# EAGLE board sch (EAGLE 7.1.0)
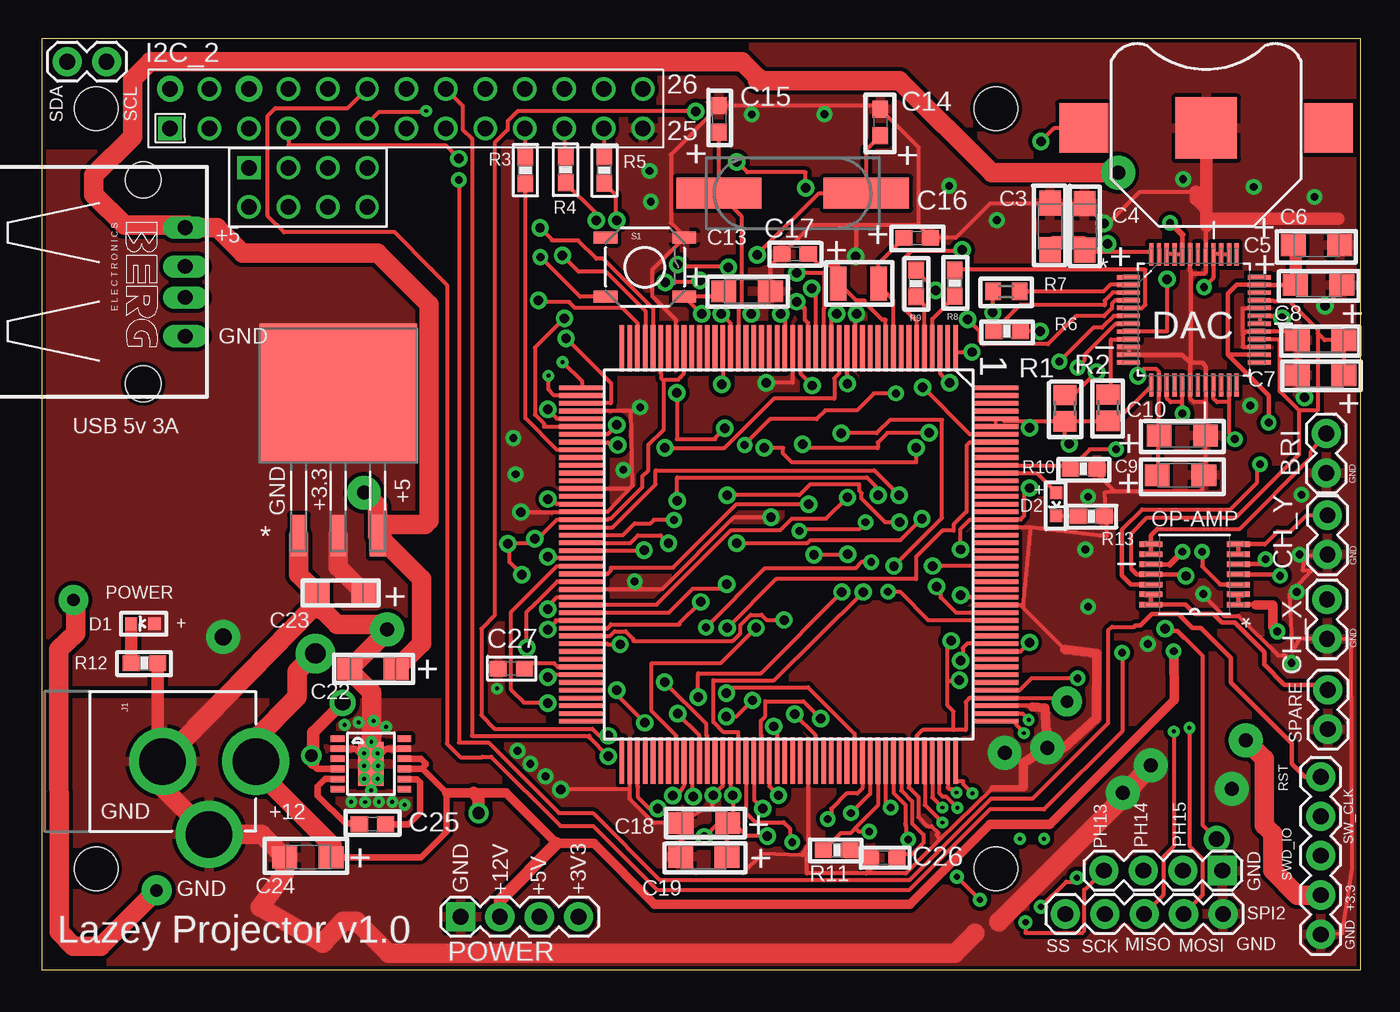
[diagram p2: board, top side]
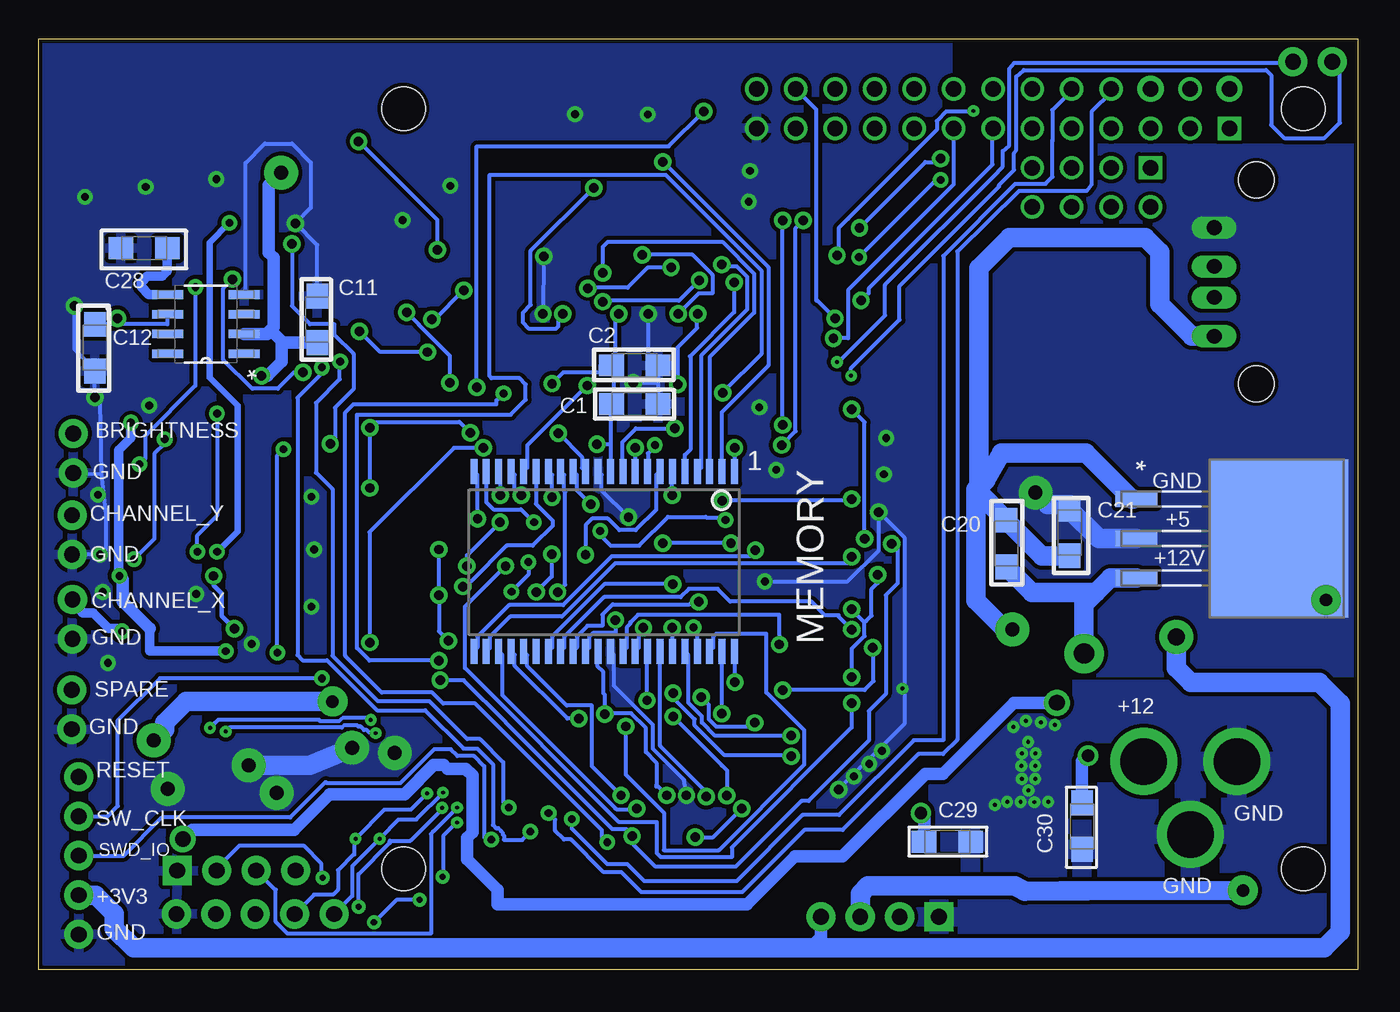
[diagram p3: board, bottom side, seen from below]

Size 85 x 60 mm. Coordinates in mm from the lower left corner, seen from the top.
Outline: 0,0 85,0 85,60 0,60 0,0
Copper layers (1*16): Top 0.035mm / dielectric 1.5mm / Bottom 0.035mm
Design rules "pcbtrain *": minimum track width 0.15mm, minimum drill 0.2mm, track to track 0.15mm, track to pad 0.15mm, pad to pad 0.15mm, via to via 0.15mm, smd to smd 0mil, copper to edge 10mil, drill to drill 0.2mm, minimum pad ring 10mil, minimum via ring 10mil, stop-mask expansion 0.125mm, vias tented up to drill 100mil, thermal gap 10mil
Net classes: 0 default: width 0.254 mm, drill 0.254 mm, clearance 0.254 mm
Holes 2.8 mm at 3.5,55.5 3.5,6.5 61.5,55.5 61.5,6.5

## Footprints (pad centres in the part's own frame; a part is rotated, then mirrored left to right if it is on the bottom)
CSM-7X-DU = smd 5.5 x 2: 1 -4.75,0; 2 4.75,0
9HT10-32.768KEZF-T = smd 1.067 x 2.184: P$1 -1.3,0; P$2 1.3,0
BATTCON_12MM = smd 3.962 x 3.962: GND 0,0 | smd 3.175 x 3.175: PWR@1 -7.874,0; PWR@2 7.874,0
1X02 = drill 1.016 pad 1.88: 1 0,0; 2 2.54,0
SMC_A = smd 1.6 x 1.4: + -1.5,0; - 1.5,0
C0603 = smd 1.1 x 1: 1 -0.85,0; 2 0.85,0
LED-0603 = smd 0.8 x 0.8: A 0,-0.75; C 0,0.75
QFP50P900X900X120-48N = smd 1.473 x 0.279: 1 -4.216,2.743; 2 -4.216,2.261; 3 -4.216,1.753; 4 -4.216,1.245; 5 -4.216,0.762; 6 -4.216,0.254; 7 -4.216,-0.254; 8 -4.216,-0.762; 9 -4.216,-1.245; 10 -4.216,-1.753; 11 -4.216,-2.261; 12 -4.216,-2.743; 25 4.216,-2.743; 26 4.216,-2.261; 27 4.216,-1.753; 28 4.216,-1.245; 29 4.216,-0.762; 30 4.216,-0.254; 31 4.216,0.254; 32 4.216,0.762; 33 4.216,1.245; 34 4.216,1.753; 35 4.216,2.261; 36 4.216,2.743 | smd 0.279 x 1.473: 13 -2.743,-4.216; 14 -2.261,-4.216; 15 -1.753,-4.216; 16 -1.245,-4.216; 17 -0.762,-4.216; 18 -0.254,-4.216; 19 0.254,-4.216; 20 0.762,-4.216; 21 1.245,-4.216; 22 1.753,-4.216; 23 2.261,-4.216; 24 2.743,-4.216; 37 2.743,4.216; 38 2.261,4.216; 39 1.753,4.216; 40 1.245,4.216; 41 0.762,4.216; 42 0.254,4.216; 43 -0.254,4.216; 44 -0.762,4.216; 45 -1.245,4.216; 46 -1.753,4.216; 47 -2.261,4.216; 48 -2.743,4.216
1X04 = drill 1.016 pad 1.88 square: 1 0,0 | drill 1.016 pad 1.88: 2 2.54,0; 3 5.08,0; 4 7.62,0
POWER_JACK_PTH = drill 2.997 pad 4.318: GND 0,7.7; GNDBREAK 4.7,10.7; PWR 0,13.7
TSOPII-44 = smd 0.45 x 1.6: 1 -7.13,-5.8; 2 -6.33,-5.8; 3 -5.53,-5.8; 4 -4.73,-5.8; 5 -3.93,-5.8; 6 -3.13,-5.8; 7 -2.33,-5.8; 8 -1.53,-5.8; 9 -0.73,-5.8; 10 0.07,-5.8; 11 0.87,-5.8; 12 1.67,-5.8; 13 2.47,-5.8; 14 3.27,-5.8; 15 4.07,-5.8; 16 4.87,-5.8; 17 5.67,-5.8; 18 6.47,-5.8; 19 7.27,-5.8; 20 8.07,-5.8; 21 8.87,-5.8; 22 9.67,-5.8; 23 9.67,5.8; 24 8.87,5.8; 25 8.07,5.8; 26 7.27,5.8; 27 6.47,5.8; 28 5.67,5.8; 29 4.87,5.8; 30 4.07,5.8; 31 3.27,5.8; 32 2.47,5.8; 33 1.67,5.8; 34 0.87,5.8; 35 0.07,5.8; 36 -0.73,5.8; 37 -1.53,5.8; 38 -2.33,5.8; 39 -3.13,5.8; 40 -3.93,5.8; 41 -4.73,5.8; 42 -5.53,5.8; 43 -6.33,5.8; 44 -7.13,5.8
LQFP176_PACKAGE = smd 3 x 0.3: 1 -13.3,10.75; 2 -13.3,10.25; 3 -13.3,9.75; 4 -13.3,9.25; 5 -13.3,8.75; 6 -13.3,8.25; 7 -13.3,7.75; 8 -13.3,7.25; 9 -13.3,6.75; 10 -13.3,6.25; 11 -13.3,5.75; 12 -13.3,5.25; 13 -13.3,4.75; 14 -13.3,4.25; 15 -13.3,3.75; 16 -13.3,3.25; 17 -13.3,2.75; 18 -13.3,2.25; 19 -13.3,1.75; 20 -13.3,1.25; 21 -13.3,0.75; 22 -13.3,0.25; 23 -13.3,-0.25; 24 -13.3,-0.75; 25 -13.3,-1.25; 26 -13.3,-1.75; 27 -13.3,-2.25; 28 -13.3,-2.75; 29 -13.3,-3.25; 30 -13.3,-3.75; 31 -13.3,-4.25; 32 -13.3,-4.75; 33 -13.3,-5.25; 34 -13.3,-5.75; 35 -13.3,-6.25; 36 -13.3,-6.75; 37 -13.3,-7.25; 38 -13.3,-7.75; 39 -13.3,-8.25; 40 -13.3,-8.75; 41 -13.3,-9.25; 42 -13.3,-9.75; 43 -13.3,-10.25; 44 -13.3,-10.75; 89 13.3,-10.75; 90 13.3,-10.25; 91 13.3,-9.75; 92 13.3,-9.25; 93 13.3,-8.75; 94 13.3,-8.25; 95 13.3,-7.75; 96 13.3,-7.25; 97 13.3,-6.75; 98 13.3,-6.25; 99 13.3,-5.75; 100 13.3,-5.25; 101 13.3,-4.75; 102 13.3,-4.25; 103 13.3,-3.75; 104 13.3,-3.25; 105 13.3,-2.75; 106 13.3,-2.25; 107 13.3,-1.75; 108 13.3,-1.25; 109 13.3,-0.75; 110 13.3,-0.25; 111 13.3,0.25; 112 13.3,0.75; 113 13.3,1.25; 114 13.3,1.75; 115 13.3,2.25; 116 13.3,2.75; 117 13.3,3.25; 118 13.3,3.75; 119 13.3,4.25; 120 13.3,4.75; 121 13.3,5.25; 122 13.3,5.75; 123 13.3,6.25; 124 13.3,6.75; 125 13.3,7.25; 126 13.3,7.75; 127 13.3,8.25; 128 13.3,8.75; 129 13.3,9.25; 130 13.3,9.75; 131 13.3,10.25; 132 13.3,10.75 | smd 0.3 x 3: 45 -10.75,-13.3; 46 -10.25,-13.3; 47 -9.75,-13.3; 48 -9.25,-13.3; 49 -8.75,-13.3; 50 -8.25,-13.3; 51 -7.75,-13.3; 52 -7.25,-13.3; 53 -6.75,-13.3; 54 -6.25,-13.3; 55 -5.75,-13.3; 56 -5.25,-13.3; 57 -4.75,-13.3; 58 -4.25,-13.3; 59 -3.75,-13.3; 60 -3.25,-13.3; 61 -2.75,-13.3; 62 -2.25,-13.3; 63 -1.75,-13.3; 64 -1.25,-13.3; 65 -0.75,-13.3; 66 -0.25,-13.3; 67 0.25,-13.3; 68 0.75,-13.3; 69 1.25,-13.3; 70 1.75,-13.3; 71 2.25,-13.3; 72 2.75,-13.3; 73 3.25,-13.3; 74 3.75,-13.3; 75 4.25,-13.3; 76 4.75,-13.3; 77 5.25,-13.3; 78 5.75,-13.3; 79 6.25,-13.3; 80 6.75,-13.3; 81 7.25,-13.3; 82 7.75,-13.3; 83 8.25,-13.3; 84 8.75,-13.3; 85 9.25,-13.3; 86 9.75,-13.3; 87 10.25,-13.3; 88 10.75,-13.3; 133 10.75,13.3; 134 10.25,13.3; 135 9.75,13.3; 136 9.25,13.3; 137 8.75,13.3; 138 8.25,13.3; 139 7.75,13.3; 140 7.25,13.3; 141 6.75,13.3; 142 6.25,13.3; 143 5.75,13.3; 144 5.25,13.3; 145 4.75,13.3; 146 4.25,13.3; 147 3.75,13.3; 148 3.25,13.3; 149 2.75,13.3; 150 2.25,13.3; 151 1.75,13.3; 152 1.25,13.3; 153 0.75,13.3; 154 0.25,13.3; 155 -0.25,13.3; 156 -0.75,13.3; 157 -1.25,13.3; 158 -1.75,13.3; 159 -2.25,13.3; 160 -2.75,13.3; 161 -3.25,13.3; 162 -3.75,13.3; 163 -4.25,13.3; 164 -4.75,13.3; 165 -5.25,13.3; 166 -5.75,13.3; 167 -6.25,13.3; 168 -6.75,13.3; 169 -7.25,13.3; 170 -7.75,13.3; 171 -8.25,13.3; 172 -8.75,13.3; 173 -9.25,13.3; 174 -9.75,13.3; 175 -10.25,13.3; 176 -10.75,13.3
SOP65P640X120-14N = smd 1.473 x 0.356: 1 -2.819,1.956; 2 -2.819,1.295; 3 -2.819,0.66; 4 -2.819,0; 5 -2.819,-0.66; 6 -2.819,-1.295; 7 -2.819,-1.956; 8 2.819,-1.956; 9 2.819,-1.295; 10 2.819,-0.66; 11 2.819,0; 12 2.819,0.66; 13 2.819,1.295; 14 2.819,1.956
1X05 = drill 1.016 pad 1.88: 1 0,0; 2 2.54,0; 3 5.08,0; 4 7.62,0; 5 10.16,0
R0805 = smd 1.3 x 1.5: 1 -0.85,0; 2 0.85,0
0603-RES = smd 1.1 x 1: 1 -0.85,0; 2 0.85,0
R0603 = smd 1 x 1.1: 1 -0.85,0; 2 0.85,0
RASPBERRY-PI_REV2-BARE = drill 1 square: P1_1 -15.24,-1.27; P5_1 -10.16,-3.81 | drill 1 pad 1.676: P1_2 -15.24,1.27; P1_6 -10.16,1.27 | drill 1: P1_3 -12.7,-1.27; P1_4 -12.7,1.27; P1_5 -10.16,-1.27; P1_7 -7.62,-1.27; P1_8 -7.62,1.27; P1_9 -5.08,-1.27; P1_10 -5.08,1.27; P1_11 -2.54,-1.27; P1_12 -2.54,1.27; P1_13 0,-1.27; P1_14 0,1.27; P1_15 2.54,-1.27; P1_16 2.54,1.27; P1_17 5.08,-1.27; P1_18 5.08,1.27; P1_19 7.62,-1.27; P1_20 7.62,1.27; P1_21 10.16,-1.27; P1_22 10.16,1.27; P1_23 12.7,-1.27; P1_24 12.7,1.27; P1_25 15.24,-1.27; P1_26 15.24,1.27; P5_2 -10.16,-6.35; P5_3 -7.62,-3.81; P5_4 -7.62,-6.35; P5_5 -5.08,-3.81; P5_6 -5.08,-6.35; P5_7 -2.54,-3.81; P5_8 -2.54,-6.35
TACTILE_SWITCH_SMD = smd 1.524 x 0.762: 1 -2.54,1.905; 2 2.54,1.905; 3 -2.54,-1.905; 4 2.54,-1.905
TO254P1435X457-3N = smd 1.016 x 2.692: 1 -2.54,-9.042; 2 0,-9.042; 3 2.54,-9.042 | smd 10.16 x 8.941: 4 0,0.152
MSOP12 = smd 0.42 x 0.889: 1 -1.625,-2.15; 2 -0.975,-2.15; 3 -0.325,-2.15; 4 0.325,-2.15; 5 0.975,-2.15; 6 1.625,-2.15; 7 1.625,2.15; 8 0.975,2.15; 9 0.325,2.15; 10 -0.325,2.15; 11 -0.975,2.15; 12 -1.625,2.15 | smd 2.845 x 1.651: 13 0,0
SOIC127P600X175-8N = smd 1.981 x 0.559: 1 -2.464,1.905; 2 -2.464,0.635; 3 -2.464,-0.635; 4 -2.464,-1.905; 5 2.464,-1.905; 6 2.464,-0.635; 7 2.464,0.635; 8 2.464,1.905
PN87520 = drill 0.95 long: 1 -3.5,2.71; 2 -1,2.71; 3 1,2.71; 4 3.5,2.71 | hole 2.3: -6.57,0; 6.57,0

## Placement (x,y rotation side)
9C-8.000MEEJ-T  8Mhz  [CSM-7X-DU]  48.38,50.04 180 top
32.768KHZ  9HT10-32.768KEZF-T  [9HT10-32.768KEZF-T]  52.62,44.22 180 top
BAT1  3.3v  [BATTCON_12MM]  75.04,54.25 0 top
BRI  M02PTH  [1X02]  82.78,32.01 90 top
C1  100n  [SMC_A]  46.59,36.45 0 bottom
C2  100n  [SMC_A]  46.59,38.94 0 bottom
C3  0.1u  [SMC_A]  64.98,47.9 90 top
C4  10u  [SMC_A]  67.2,47.87 90 top
C5  0.1u  [SMC_A]  82.29,44.13 0 top
C6  10u  [SMC_A]  82.16,46.7 0 top
C7  0.1u  [SMC_A]  82.42,38.31 0 top
C8  10u  [SMC_A]  82.41,40.57 0 top
C9  0.1u  [SMC_A]  73.38,31.87 0 top
C10  10u  [SMC_A]  73.5,34.42 0 top
C11  1u  [SMC_A]  67.05,41.91 90 bottom
C12  22u  [SMC_A]  81.39,40.09 270 bottom
C13  0.1u  [SMC_A]  45.45,43.72 0 top
C14  16p  [C0603]  54.03,54.61 270 top
C15  16p  [C0603]  43.65,54.84 270 top
C16  5p  [C0603]  56.41,47.15 180 top
C17  5p  [C0603]  48.54,46.13 0 top
C18  0.1u  [SMC_A]  42.7,9.43 180 top
C19  10u  [SMC_A]  42.65,7.25 180 top
C20  10u  [SMC_A]  22.63,27.46 90 bottom
C21  10u  [SMC_A]  18.57,28.17 270 bottom
C22  10u  [SMC_A]  21.34,19.38 180 top
C23  10u  [SMC_A]  19.25,24.29 180 top
C24  10u  [SMC_A]  17.14,7.24 180 top
C25  1u  [C0603]  21.31,9.38 0 top
C26  2.2u  [C0603]  54.25,7.21 0 top
C27  2.2u  [C0603]  30.25,19.41 0 top
C28  1u  [SMC_A]  78.21,46.51 180 bottom
C29  10u  [SMC_A]  26.44,8.23 0 bottom
C30  10u  [SMC_A]  17.75,9.25 90 bottom
CH_X  M02PTH  [1X02]  82.83,21.31 90 top
CH_Y  M02PTH  [1X02]  82.85,26.75 90 top
D1  KP-1608CGCK  [LED-0603]  6.5,22.3 90 top
D2  KP-1608CGCK  [LED-0603]  65.38,30 180 top
DAC  DAC8734SPFB  [QFP50P900X900X120-48N]  74.25,41.89 0 top
GPIO  [1X04]  76.07,6.38 180 top
I2C_2  M02PTH  [1X02]  1.63,58.52 0 top
J1  POWER_JACKPTH  [POWER_JACK_PTH]  0.08,13.41 270 top
MEMORY  AS7C34098A-12TIN  [TSOPII-44]  47.29,26.31 180 bottom
MICROCONTROLER  STM32F42X_43X_LQFP176  [LQFP176_PACKAGE]  48.13,26.76 270 top
OP-AMP  MC33074ADTBG  [SOP65P640X120-14N]  74.3,25.48 180 top
POWER  [1X04]  26.97,3.4 0 top
PROGRAM  [1X05]  82.42,2.26 90 top
R1  10k  [R0805]  65.93,36.19 90 top
R2  10k  [R0805]  68.72,36.22 90 top
R3  20R  [0603-RES]  31.17,51.51 90 top
R4  20R  [0603-RES]  33.76,51.56 90 top
R5  20R  [0603-RES]  36.25,51.54 90 top
R6  20R  [0603-RES]  62.2,41.15 0 top
R7  20R  [R0603]  62.15,43.72 180 top
R8  20  [0603-RES]  58.83,44.25 270 top
R9  20  [0603-RES]  56.34,44.22 270 top
R10  10k  [0603-RES]  67.13,32.29 0 top
R11  10k  [0603-RES]  51.23,7.7 0 top
R12  68R  [0603-RES]  6.6,19.76 180 top
R13  68R  [0603-RES]  67.64,29.21 0 top
RASPBERRY_PI  RASPBERRY-PI_REV2-BARE  [RASPBERRY-PI_REV2-BARE]  23.5,55.5 0 top
S1  [TACTILE_SWITCH_SMD]  38.87,45.28 0 top
SPARE  M02PTH  [1X02]  82.88,15.49 90 top
SPI_2  [1X05]  65.96,3.58 0 top
U2  LM1085IS-3.3  [TO254P1435X457-3N]  19.1,37.01 0 top
U3  LM1085IS-5.0  [TO254P1435X457-3N]  5.21,27.79 270 bottom
U$1  LTC3261  [MSOP12]  21.21,13.26 270 top
VREF1  REF5025AID  [SOIC127P600X175-8N]  74.23,41.61 180 bottom
X1  [PN87520]  6.53,44.33 270 top

## Tracks (layer width: path | path; a pad name or v marks a point on that pad's centre or on a via)
+3V3  (via drill 0.61, 0.8 pad 1.93, 0.9 pad 2.18, 1.1 pad 2.18)
  Top 0.254: v48.51,16.46 49.89,15.09 MICROCONTROLER.114 | 43.97,9.43 C18.+ | 44.42,9.43 44.32,9.43 C18.+ | MICROCONTROLER.103 44.37,13.44 44.37,11.38 v44.53,11.23 44.53,9.76 C18.+ | v39.7,10.37 39.17,10.37 38.43,11.1 38.43,11.79 38.38,11.84 38.38,13.44 MICROCONTROLER.91 | C18.+ 43.87,9.43 43.54,9.43 43.51,9.4 43.51,9.35 v42.7,8.54 42.6,8.46 | v32.61,23.22 32.61,23.42 33.2,24.01 MICROCONTROLER.72 | MICROCONTROLER.82 32.92,19 v32.61,18.85 | 31.86,27.68 31.7,27.51 30.12,27.51 | 31.86,27.68 33.2,29.01 MICROCONTROLER.62 34.95,29.01 36.47,29.01 36.52,29.06 36.68,29.06 38.71,31.09 38.71,31.8 39.09,32.19 39.09,33.84 40.08,34.83 40.08,37.95 | 30.12,27.51 30.12,26.27 v30.94,25.45 | v32.61,36.12 32.61,36.1 33.2,35.51 34.75,35.51 34.77,35.49 34.8,35.51 MICROCONTROLER.49 | v31.77,27.77 31.86,27.68 | 40.08,37.95 39.93,38.1 39.93,38.38 39.88,38.43 39.88,40.03 MICROCONTROLER.39 | MICROCONTROLER.36 41.38,40.03 41.38,38.41 41.17,38.2 41.17,38.18 41.02,38.03 40.18,38.03 40.08,37.95 | v30.02,27.46 30.12,27.51 | 58.75,15.45 59.54,15.45 59.54,17.25 59.79,17.5 61.42,17.5 MICROCONTROLER.136 65.83,17.5 v66.06,17.27 | 58.75,15.45 56.74,15.45 56.39,15.09 MICROCONTROLER.127 | v59.21,24.13 59.21,24.06 59.74,24.06 59.79,24.01 61.42,24.01 MICROCONTROLER.149 | 58.37,18.62 58.37,17.02 58.75,16.64 58.75,15.45 | 58.37,18.62 58.37,20.88 58.6,21.11 v58.6,21.19 | v59.21,27.08 59.21,28.4 59.82,29.01 61.42,29.01 MICROCONTROLER.159 61.54,29.01 63.07,29.01 63.32,29.26 63.32,30.71 v63.65,31.04 | MICROCONTROLER.23 47.88,42.01 v47.62,42.27 | v51.92,37.77 51.92,38.38 51.89,38.41 51.89,40.03 MICROCONTROLER.15
  Top 0.254: DAC.48 71.5,46.26 71.48,46.28 67.21,46.28 67.21,46.36 C4.+ 67.21,46.51 | 67.21,46.51 67.21,47.15 65.1,47.15 64.97,47.02 C3.+ | MICROCONTROLER.171 61.44,35.03 61.44,35.49 MICROCONTROLER.172 61.57,35.51 61.87,35.51 61.87,35.49 62.03,35.33 63.65,35.33 | DAC.13 71.5,37.65 71.5,37.62 69.42,35.54 69.42,35.41 69.39,35.38 68.73,35.38 R2.1 68.61,35.38 68.02,35.38 68,35.36 68,35.33 R1.1 | R1.1 | 63.65,35.33 65.81,35.33 R1.1 | 65.96,35.21 R1.1 | v57.17,34.6 54.48,34.6 53.87,33.99 53.87,33.61 49.28,33.61 v49.02,33.86 | 63.65,35.33 v63.65,34.93 63.32,35.23 | C18.+ 44.53,9.43 44.91,9.43 44.91,9.15 45.39,8.66 46.71,8.66 v46.76,8.61 | C19.+ 44.15,9.39 C18.+ | 67.21,46.51 68.4,46.51 v68.68,46.79 | 58.37,18.62 59.11,18.62 v59.13,18.65 | R1.1 65.94,34.98 65.91,34.95 65.91,34.19 v66.22,33.89
  Top 1.27: U2.2 19.1,25.94 C23.+ | v77.6,14.79 78.79,13.59 78.79,9.3 79.32,8.76 79.32,6.4 80.92,4.8 PROGRAM.2
  Bottom 0.254: MEMORY.33 48.97,19.54 48.62,19.18 48.62,17.81 48.51,17.71 v48.51,16.46 48.41,16.51 46.81,16.51 45.87,15.57 45.87,14.02 45.19,13.34 45.19,11.89 | v39.7,10.37 41.53,8.54 v42.7,8.54 | 45.19,11.79 45.19,11.89 | 31.77,22.38 v32.61,23.22 | 31.77,22.38 31.77,21.49 32.61,20.65 v32.61,18.85 | v30.94,25.45 30.94,24.92 31.32,24.54 31.32,22.81 31.67,22.46 31.77,22.38 | v32.61,36.12 31.77,35.28 v31.77,27.77 | v30.02,27.46 29.64,27.08 29.64,24.89 30.4,24.13 30.4,17.76 31.5,16.66 31.5,14.76 35.38,10.87 35.84,10.87 40.08,6.63 45.24,6.63 46.66,8.05 46.66,8.51 v46.76,8.61 47.14,8.99 47.14,9.04 48.03,9.04 54.89,15.9 54.89,15.93 57.61,18.64 v59.13,18.64 v59.13,18.65 | v59.21,27.08 v59.21,24.13 59.21,21.8 v58.6,21.19 | C2.+ 47.95,38.94 47.95,36.45 C1.+ 48.16,36.35 48.16,33.84 | 48.16,33.84 48.16,32.13 MEMORY.11 | C2.+ 47.85,38.92 47.83,38.94 47.83,42.06 v47.62,42.27 | v51.92,37.77 51.21,38.48 48.82,38.48 48.82,38.92 48.79,38.94 48.21,38.94 C2.+ | v57.17,34.6 57.89,35.31 63.65,35.31 v63.65,34.93 v63.65,31.04 | v49.02,33.86 48.18,33.86 48.16,33.84 | v68.68,46.79 68.68,42.78 67.51,41.61 65.96,41.61 65.96,40.95 64.72,39.7 64.72,37.42 65.91,36.22 65.91,34.19 v66.22,33.89 | 45.19,11.89 v44.53,11.23
  Bottom 0.813: POWER.4 34.59,2.08 35.28,1.4
  Bottom 1.27: v66.06,17.27 75.51,17.27 76.89,15.9 76.89,15.5 v77.6,14.79 | v11.68,21.44 11.68,19.46 10.74,18.52 2.46,18.52 1.12,17.17 1.12,2.44 2.16,1.4 35.28,1.4 78.89,1.4 80.14,2.64 80.14,3.61 81.33,4.8 PROGRAM.2
  pour Top (no thermals): -0.18,52.76 25.93,52.76 25.93,18.39 -0.05,18.39 -0.05,18.32 -0.18,18.32
+5V  (via drill 0.61, 0.8 pad 1.93, 0.9 pad 2.18)
  Top 0.254: C9.+ 71.93,31.93 71.93,34.32 C10.+ 71.98,34.45 71.98,37.65 DAC.14 71.98,37.8 71.98,38.56 71.81,38.74 70.99,38.74 70.99,38.64 v70.64,38.28 | X1.1 9.4,47.99 | 22.05,27.56 U2.3
  Top 1.27: X1.1 11.28,47.83 12.93,46.18 21.64,46.18 24.97,42.85 24.97,28.96 24.69,28.68 22.35,28.68 U2.3 21.64,29.85 v20.75,30.74 | 22.05,27.56 22.1,27.56 24.49,25.17 24.49,21.03 C22.+ | 9.4,47.99 5.33,47.99 3.35,49.97 3.35,51.21 5.84,53.7 5.84,57.38 6.99,58.52 45.11,58.52 46.13,57.51 46.13,57.3 55.27,57.3 61.21,51.36 v69.37,51.36 | v2.03,23.82 2.18,23.67 2.18,21.67 1.07,20.65 1.12,2.44 2.03,1.5 3.79,1.5 v7.39,5.11
  Bottom 0.254: C11.+ | 71.75,40.95 VREF1.2 | C21.+ 18.57,29.98
  Bottom 0.813: VREF1.2 70.28,40.97 70.04,41.21 | 70.04,41.21 69.85,41.41 69.85,45.9 70.18,46.23 70.18,50.55 v69.37,51.36 | C11.+ 69.24,40.41 | 69.24,40.41 70.04,41.21 | v70.64,38.28 70.26,38.28 69.34,39.2 69.34,40.31 69.24,40.41
  Bottom 1.27: U3.2 16.69,27.79 C21.+ | 18.57,29.98 19.99,29.98 v20.75,30.74 | POWER.3 32.05,4.88 31.55,5.38 22.1,5.38 21.44,5.05 19.13,5.08 17.42,5.08 v7.39,5.11
  pour Bottom (no thermals): -0.05,53.11 25.63,53.11 25.68,19 0.15,19 0.1,53.04
+12V  (via drill 0.5, 0.8, 1.3 pad 2.54)
  Top 0.254: DAC.26 | 78.46,44.12 DAC.35 78.59,44.12 | 80.77,44.12 C5.+ 80.82,44.25 | 80.82,46.59 80.95,46.71 C6.+ | 23.41,12.88 U$1.9
  Top 0.305: 78.59,44.12 C5.+ | v79.07,35.26 79.07,37.01 76.43,39.65 | DAC.26 78.44,39.65 76.43,39.65 | 76.43,39.65 76.43,43.56 77.01,44.15 DAC.35 | OP-AMP.4 79.71,25.48 v79.81,25.38
  Top 0.406: U$1.10 24.44,13.59 24.74,13.29 24.74,13.19 24.49,12.93 | 24.49,12.93 U$1.9 | 24.49,12.93 24.54,12.93 26.09,11.38 26.09,8.89 24.43,7.24 C24.+ | 79.73,25.45 v79.81,25.38
  Top 0.61: 26.09,11.38 27.81,11.38 29.92,11.38 33.17,8.13 35.59,8.13 39.5,4.22 55.93,4.22 61.09,9.38 64.97,9.38 72.97,17.38 v72.95,20.53 | 80.82,44.17 C5.+
  Top 0.813: 80.82,44.17 80.82,46.53 C6.+ | v28.14,10.08 28.14,11.05 27.81,11.38 | POWER.2 29.52,4.47 33.17,8.13
  Top 1.27: C24.+ 18.72,7.32 18.72,8 13.78,12.95 J1.PWR 13.66,13.53 13.66,14.79 16.46,17.58 16.46,19.2 v17.63,20.37
  Bottom 0.254: 79.68,25.5 v79.81,25.38
  Bottom 0.61: v79.07,35.26 79.07,34.27 79.86,33.48 79.86,25.43 v79.81,25.38 | 77.85,22 77.85,20.53 v72.95,20.53
  Bottom 0.813: 77.85,22 79.58,23.73 79.58,25.15 v79.81,25.38 | C29.+ 27.92,9.86 v28.14,10.08
  Bottom 1.27: U3.3 15.93,25.25 16.87,24.31 | 16.87,24.31 20.98,24.31 C20.+ | v17.63,20.37 17.63,23.55 16.87,24.31
-12V  (via drill 0.6, 0.8, 1 pad 1.68)
  Top 0.254: 81.03,36.05 79.78,37.29 79.78,40.62 78.49,40.62 DAC.28 | 81.03,36.05 82.22,36.05 82.22,41.02 | 82.22,41.02 82.22,41.25 80.39,43.08 79.4,43.08 79.35,43.13 78.49,43.13 DAC.33 | 82.22,41.02 82.67,40.57 C8.- C7.- | 70.21,25.84 70.21,28.12 71.22,29.14 76.94,29.14 81.03,33.23 81.03,36.05 | 73.66,21.39 74.8,20.25 74.8,9.32 v75.72,8.41 | 17.6,13.08 17.48,13.31
  Top 0.305: 70.21,25.84 70.56,25.48 OP-AMP.11 73.64,25.48 v73.74,25.38 | 73.66,21.39 73.63,21.39 73.18,21.84 72.52,21.84 v72.39,21.97
  Top 0.406: U$1.4 17.75,12.94 17.6,13.08 17.45,13.24
  Top 0.813: 17.48,13.31 17.48,13.41 | 17.48,13.41 17.48,15.29 v19.38,17.2 | v17.37,13.79 17.37,13.51 17.48,13.41
  Bottom 0.305: v73.74,25.38 73.74,24.77 73.2,24.23 73.2,22.78 v72.39,21.97
  Bottom 0.813: v19.38,17.2 22.15,17.2 26.72,12.63 27.86,12.63 33.2,7.29 36.27,7.29 39.37,4.19 55.43,4.19 55.43,5.13 57.4,7.11 57.4,8.48 57.05,8.84 57.05,12.52 57.48,12.93 58.65,12.93 58.9,13.18 59.54,13.18 61.42,11.28 66.27,11.28 68.53,9.02 75.11,9.02 v75.72,8.41 | C30.- 17.75,13.41 v17.37,13.79
BOOT0  (via drill 0.5)
  Top 0.254: MICROCONTROLER.166 66.06,32.51 R10.1 67.53,33.53 v69.24,33.53 | v69.62,20.42 69.62,15.34 64.59,10.31 61.09,10.31 55.91,5.13 39.65,5.13 35.53,9.25 33.43,9.25 28.96,13.72 28.4,13.72 28.37,13.69 26.98,13.69 26.11,14.56 26.11,44.12 25.09,45.14 25.09,45.16 22.73,47.53 15.6,47.53 14.55,48.57 14.55,55.05 15.04,55.53 19.72,55.53 RASPBERRY_PI.P1_12
  Bottom 0.254: v69.62,20.42 69.62,33.15 v69.24,33.53
BRIGHTNESS
  Top 0.254: BRI.2 81.79,33.4 81.79,32.99 77.19,28.4 71.88,28.4
  Top 0.305: OP-AMP.9 OP-AMP.8 71.48,27.99 71.88,28.4
CHANNEL_X  (via drill 0.5)
  Top 0.305: OP-AMP.2 OP-AMP.1 78.21,23.52 78.23,23.5
  Top 0.61: 78.23,23.5 79.32,23.5 79.32,22.1 v79.63,21.8
  Bottom 0.61: v79.63,21.8 79.83,22 80.5,22 81.48,22.99 82.17,22.99 CH_X.2
CHANNEL_Y
  Top 0.254: 78.82,27.41 79.65,28.25 80.47,28.25 81.53,29.31 83.01,29.31 CH_Y.2
  Top 0.305: OP-AMP.6 OP-AMP.7 78.79,27.43 78.82,27.41
DAC_CS
  Top 0.254: R7.1 68.43,43.72 68.86,44.15 DAC.2
DAC_LDAC  (via drill 0.5 pad 1.02)
  Top 0.254: MICROCONTROLER.123 54.38,10.77 v54.71,10.44 | DAC.6 69.09,42.14 68.33,41.38 67.76,41.38 v65.58,39.2
  Bottom 0.254: v65.58,39.2 65.61,39.17 65.61,38.05 67.13,36.53 67.13,32.03 66.06,30.96 66.06,20.22 63.14,17.3 59.82,17.3 57.38,14.86 56.57,14.86 55.07,13.36 55.07,10.8 v54.71,10.44
DAC_REF  (via drill 0.61)
  Top 0.254: DAC.30 78.49,41.63 78.49,42.12 DAC.31
  Top 0.305: 78.49,42.12 79.81,42.12 v79.93,41.99
  Bottom 0.254: 79.93,41.61 76.71,41.61 76.71,42.22 VREF1.6 | 79.93,41.61 81.38,41.61 C12.+ | 79.93,41.61 v79.93,41.99
DAC_RST  (via drill 0.5 pad 1.02)
  Top 0.254: 53.9,13.44 MICROCONTROLER.122 53.88,10.58 52.43,9.12 | DAC.7 69.22,41.63 67.18,39.6 67.18,39.25 v66.75,38.81 | v53.31,8.89 52.65,8.89 52.43,9.12 | 52.43,9.12 52.09,8.79 51.47,8.79 R11.1
  Bottom 0.254: 53.59,8.61 v53.31,8.89 53.85,8.36 54.99,8.36 55.02,8.38 55.02,8.64 55.09,8.71 55.09,8.79 55.22,8.91 55.22,8.97 55.37,9.12 55.52,9.12 55.73,9.32 55.73,13.23 56.74,14.25 57.63,14.25 60.1,16.71 63.2,16.71 66.42,19.94 68,19.94 68.33,20.27 68.33,36.86 66.83,38.36 66.83,38.74 v66.75,38.81
DAC_SCLK
  Top 0.254: R6.1 61.37,41.15 63.04,42.83 68.5,42.83 68.5,43.13 69.01,43.64 DAC.3
DAC_SDI  (via drill 0.61)
  Top 0.254: v57.61,43.79 R9.1 | v59.66,41.91 60.45,41.12 60.45,40.52 60.66,40.31 64.85,40.31 66.65,42.12 68.45,42.12 68.96,42.62 68.96,42.93 69.16,43.13 DAC.4
  Bottom 0.254: v57.61,43.79 59.49,41.91 v59.66,41.91
DAC_SDO
  Top 0.254: R8.1 58.83,45.11 71.12,45.11 71.12,42.85 70.89,42.62 70.05,42.62 DAC.5
DAC_SPARE
  Top 0.305: OP-AMP.13 OP-AMP.14 73.71,23.52 74.32,22.91 75.51,22.91 76.05,22.38 76.89,22.38 78.79,20.47 78.79,19.66 80.09,18.36 82.55,18.36 SPARE.2
DAC_VOUT0  (via drill 0.5)
  Top 0.254: 73.48,36.58 72.75,36.58 72.52,36.81 72.52,37.65 DAC.15 | 73.48,36.58 73.48,37.65 DAC.17 | 73.48,36.58 73.48,35.87 v73.51,35.84 | v74.78,26.93 74.78,25.99 75.92,24.84
  Top 0.305: OP-AMP.3 75.95,24.82 75.92,24.84
  Bottom 0.254: v73.51,35.84 73.51,29.26 74.78,27.99 v74.78,26.93
DAC_VOUT1  (via drill 0.5)
  Top 0.254: 76.5,36.58 75.74,36.58 75.51,36.81 75.51,37.65 DAC.21 | 76.5,36.58 76.5,37.65 DAC.23 | 76.5,36.58 76.5,34.57 v76.89,34.19
  Top 0.305: OP-AMP.5 78.56,26.14 v78.87,26.44
  Bottom 0.254: v76.89,34.19 76.89,33.91 77.55,33.25 77.55,27.77 v78.87,26.44
DAC_VOUT2  (via drill 0.5)
  Top 0.254: DAC.46 72.52,46.1 DAC.45 73.13,46.1 DAC.44
  Top 0.305: DAC.44 73.49,47.37 | 72.69,26.11 71.5,26.11 OP-AMP.10
  Top 0.406: 72.69,26.11 v73.51,26.93 | 73.49,47.37 v72.72,48.14
  Bottom 0.406: v73.51,26.93 72.19,28.25 72.19,36.35 73.99,38.15 73.99,46.87 v72.72,48.14
DAC_VOUT3  (via drill 0.5)
  Top 0.254: DAC.38 76.12,46.1 DAC.39 75.51,46.1 DAC.40 75.5,44.59 v74.91,44 | 69.67,28.43 70.92,29.67 76.61,29.67 78.33,31.4 78.33,32.39 v78.51,32.57
  Top 0.305: OP-AMP.12 70.18,24.82 69.6,25.4 69.6,28.35 69.67,28.43
  Bottom 0.254: v74.91,44 74.91,37.65 78.16,34.39 78.16,32.92 v78.51,32.57
GND  (via drill 0.25, 0.5, 0.5 pad 1.02, 0.61, 0.9 pad 2.18)
  Top 0.254: v46.99,29.16 44.6,29.16 39.95,24.51 38.71,24.51 | 34.85,24.51 MICROCONTROLER.71 34.84,24.51 38.71,24.51 | MICROCONTROLER.37 40.87,41.86 39.34,43.39 39.34,45.11 S1.2 41.38,47.3 40.54,48.14 40.54,52.53 43.59,55.58 C15.1 43.66,55.68 53.98,55.68 53.98,55.58 C14.1 54.05,55.45 56.52,52.99 56.52,47.98 | v46.69,37.82 48.39,37.82 48.39,40.03 MICROCONTROLER.22 | 56.52,47.98 56.52,47.96 57.2,47.27 C16.1 57.28,47.17 58.9,47.17 61.11,49.38 64.97,49.38 C3.- 65.1,49.38 67.18,49.38 C4.- 67.28,49.28 v68.45,48.11 68.56,48.19 68.81,48.19 70.76,50.14 74.37,50.14 | 56.52,47.98 52.45,47.98 | 52.45,47.98 49.61,47.98 47.8,46.18 C17.1 47.68,46.1 46.97,45.39 46.97,43.74 C13.- 46.89,43.62 46.89,43.44 v45.72,42.27 | v52.5,42.27 52.4,42.22 52.4,40.06 MICROCONTROLER.14 | 52.45,47.98 v52.45,45.98 | C18.- 41.2,7.3 C19.- 42.18,6.23 45.19,6.23 46.43,7.47 49,7.37 | MICROCONTROLER.102 43.87,13.44 43.87,11.84 v43.26,11.23 43.33,11.13 43.18,10.98 43.18,10.39 42.42,10.21 41.33,9.45 C18.- | 37.9,11.61 37.9,10.98 39.42,9.45 41.07,9.45 C18.- | 37.9,11.61 37.9,13.44 MICROCONTROLER.90 | v30.86,29.49 34.82,29.49 MICROCONTROLER.61 34.95,29.52 36.47,29.52 38.08,31.19 | 37.9,11.61 v33.45,11.61 | 38.08,31.19 37.97,35.99 34.85,35.99 MICROCONTROLER.48 | MICROCONTROLER.113 49.38,13.44 49.38,8.05 49,7.37 | MICROCONTROLER.126 55.88,13.44 55.88,11.73 56.49,11.12 56.49,9.83 57.07,9.25 57.34,9.25 57.78,8.8 57.67,8.7 57.85,8.37 | 63.18,23.38 63.07,23.5 61.44,23.5 MICROCONTROLER.148 | 61.44,17.02 MICROCONTROLER.135 | 63.73,28.5 61.44,28.5 MICROCONTROLER.158 | 63.73,28.5 63.27,23.47 63.18,23.38 | DAC.10 70.05,40.11 70.05,39.63 DAC.11 70.18,39.63
  Top 0.254: 75.01,36.58 74.24,36.58 74.02,36.81 74.02,37.65 DAC.18 73.97,37.8 | 75.01,36.58 75.01,37.65 DAC.20 | 75.01,36.58 75.01,34.55 C10.- 74.98,34.42 74.98,31.96 74.91,31.88 C9.- 74.78,31.8 74.78,30.81 69.16,30.81 | 77.48,41.01 77.6,41.12 DAC.29 78.59,41.12 80.87,41.12 80.87,40.69 C8.+ 80.92,40.57 80.92,38.33 C7.+ 80.92,38.18 80.92,37.34 v81.38,36.88 | 77.48,41.01 77.39,40.92 77.39,40.13 DAC.27 | DAC.32 78.46,42.62 77.39,42.62 77.39,41.1 77.48,41.01 | 74.02,46.08 DAC.43 | 75.01,46.08 DAC.41 75.01,46.23 | 75.01,47.76 75.06,47.76 75.06,47.91 | 83.77,44.15 C5.- 83.72,44.02 83.72,43.79 v82.7,42.78 | 75.06,54.23 BAT1.GND | 69.16,30.81 68.48,30.74 68.63,27.92 63.73,28.5 | 38.71,24.51 v38.2,25.02 | 53.11,6.2 55.68,6.2 57.85,8.37 | 53.11,6.2 49.3,6.2 49.3,7.47 49,7.37 | R10.2 67.98,32 69.16,30.81 | 81.25,25.73 81.79,25.68 80.44,24.21 80.62,20.53 81.05,21.31 CH_X.1 84.38,21.29 84.45,6.53 83.82,2.34 PROGRAM.1 | 81.25,25.73 81.43,26.7 CH_Y.1 | 65.94,20.63 63.18,23.38 | MICROCONTROLER.58 37.83,31 38.08,31.19 | v81.05,26.75 81.31,26.44 81.25,25.73 | 20.61,14.24 20.88,13.97 20.88,13.59 U$1.13 21.23,13.29 | 16.51,26.88 16.51,27.92 U2.1 | 19.86,19.38 C22.- 19.68,19.23 | C23.- 17.55,24.29 | v74.85,24.21 74.85,24.13 76.17,22.81 77.11,22.81 79.68,20.24 80.17,20.24 v80.54,19.76 | 57.85,8.37 61.27,11.68 | 63.2,11.68 63.27,11.79 | C26.1 53.4,6.49 53.11,6.2
  Top 0.305: 70.18,39.63 73.51,39.63 74.02,39.12 74.02,37.69 DAC.18 | DAC.20 75.01,38.88 74.78,39.12 74.09,39.12 74.04,39.07 74.04,44.73 | 74.04,44.73 74.04,44.99 73.99,45.04 DAC.43 | DAC.41 75.01,44.97 74.91,44.86 74.17,44.86 74.04,44.73 | 75.01,46.23 75.01,48.21 75.06,48.26 | 61.44,17.02 63.63,17.02 63.83,16.92
  Top 0.406: U$1.2 20.23,14.24 U$1.13 22.18,14.24 U$1.11 | 63.2,11.68 61.27,11.68
  Top 0.61: 63.83,16.92 64.64,16.87 v64.8,14.3 | v64.8,14.3 65.86,14.28 67.97,16.18 68,20.37 65.94,20.63 | 63.27,11.79 63.27,13.31 v64.8,14.3
  Top 0.813: 83.54,48.41 75.56,48.41 75.06,47.91 75.06,48.26 75.06,48.97 | 83.96,44.3 C5.- | 75.06,48.97 75.06,54.23 BAT1.GND | 74.37,50.14 74.37,49.66 75.06,48.97 | 83.96,46.47 83.74,46.69 | 83.64,46.79 83.74,46.69 | 83.74,46.69 83.74,46.86 | R12.1 7.45,13.74 J1.GND
  Top 1.27: U2.1 16.56,25.48 C23.- | C22.- 22.25,21.8 v22.25,21.92 21.92,22.25 19.02,22.25 18.09,23.19 17.45,23.32 | 19.86,19.38 19.86,19.26 21.26,17.86 21.26,13.31 U$1.13 | C24.- 14.17,8.71 J1.GNDBREAK 7.78,11.71 J1.GND 17.45,23.32 | 15.64,6.48 15.64,6.23 14.07,4.02 18.09,1.71 19.41,3.1 20.29,3.1 22.35,1.04 58.85,1.04 60.15,2.34 | 61.67,3.08 69.9,11.31 69.9,11.43 v71.48,13.16 | 17.55,24.29 17.45,23.32
  Bottom 0.254: v46.99,29.16 48.72,30.89 48.72,31.88 48.95,32.11 MEMORY.12 49,32.23 | 45.09,37.82 C2.- 45.11,39.07 45.72,39.68 v45.72,42.27 | 45.09,37.82 45.09,36.48 C1.- | v46.69,37.82 45.09,37.82 | C11.- 67.06,43.44 67.06,46.71 v68.45,48.11 67.46,49.1 67.46,52.02 68.68,53.24 70.43,53.24 71.68,52 71.68,43.59 71.75,43.51 VREF1.4 | v52.45,45.98 v52.5,42.27 | v43.26,11.23 43.41,12.22 45.41,14.23 45.41,15.78 47.93,18.29 47.93,20.27 MEMORY.34 | v33.45,11.61 29.18,15.88 29.18,27.82 v30.86,29.49 30.86,27.03 32.87,25.02 v38.2,25.02 | v82.7,42.78 82.7,40.01 81.41,38.71 C12.- v81.38,36.88 81.05,36.55 80.95,31.98 82.73,31.91 80.97,31.96 | BRI.1 80.97,31.96 | 80.97,31.96 80.67,29.34 80.7,26.75 CH_Y.1 | U3.1 14.45,30.33 | 22.66,28.99 C20.-
  Bottom 0.61: v64.8,14.3 64.85,14.43 64.82,14.4
  Bottom 1.27: 14.45,30.33 14.55,30.33 17.53,33.3 22.96,33.3 23.95,31.55 24.51,30.99 24.61,30.94 | C21.- 20.34,26.67 C20.- 24.61,30.94 | v22.25,21.92 22.73,21.92 24.61,23.8 24.61,30.94 | X1.4 10.67,40.83 12.75,42.9 12.75,46.26 13.66,47.17 22.45,47.17 24.41,45.22 24.41,31.14 24.61,30.94 | v71.48,13.16 67.54,13.16 v64.8,14.3
  other vias: 62.05,13.97 69.67,11.38 76.68,11.64 32.46,12.45 31.47,13.26 30.66,14.1 80.87,24.34 67.44,23.4 67.26,27.08 67.44,30.48 77.88,36.35 82.02,49.81 78.11,50.45 73.56,50.96 61.54,48.31 58.47,50.52 50.44,55.15 45.75,55.12 39.17,51.49 39.24,49.51 38.56,36.25 37.47,32.21 30.53,31.93 30.38,34.27 19.51,15.77 20.42,15.93 21.39,16.03 22.17,15.65 21.23,14.68 21.64,13.94 20.75,13.94 21.67,13.13 20.78,13.13 21.64,12.29 20.78,12.29 21.21,11.56 23.37,10.62 22.58,10.82 21.72,10.82 20.83,10.79 19.94,10.82 29.34,18.11 81.18,30.61 71.27,20.98
  pour Top: 0.05,17.17 26.7,17.17 26.54,60.83 85.04,60.83 85.04,0 0,0 0.05,15.29
  pour Bottom: 26.42,2.92 26.42,60.91 84.84,60.91 84.84,0 26.57,0 26.57,3.08
  pour Bottom: -0.05,18.06 38.51,18.06 38.51,-0.2 -0.15,-0.2 -0.15,17.96
I2C2_SCL  (via drill 0.25)
  Top 0.254: MICROCONTROLER.45 34.83,37.89 v33.55,39.17
  Bottom 0.254: v33.55,39.17 33.45,39.17 30.45,42.16 30.45,44.15 23.16,51.44 23.16,51.46 22.86,51.77 22.86,52.76 22.45,53.11 22.45,58.06 22.12,58.45 4.17,58.45 I2C_2.2
I2C2_SDA  (via drill 0.25)
  Top 0.254: MICROCONTROLER.46 33.02,37.01 32.64,37.39 v32.64,38.28
  Bottom 0.254: v32.64,38.28 32.64,38.76 29.52,41.88 29.52,44.07 23.11,50.47 23.11,50.57 22.15,51.54 22.15,52.63 22,52.83 22,57.56 21.51,57.99 5.89,57.99 5.56,57.66 5.56,54.43 4.72,53.59 2.13,53.59 1.14,54.59 1.14,58.04 I2C_2.1
MEM_ADDR0  (via drill 0.61)
  Top 0.254: MICROCONTROLER.16 51.38,40.03 51.38,38.43 51.08,38.13 51.08,36.81 47.17,36.81 43.99,33.63 v40.16,33.63
  Bottom 0.254: v40.16,33.63 40.16,32.13 MEMORY.1
MEM_ADDR1  (via drill 0.61)
  Top 0.254: v44.78,52.07 45.47,51.39 49.23,51.39 v49.23,50.4 | v51.23,42.27 50.9,41.94 50.9,40.06 MICROCONTROLER.17
  Bottom 0.254: v44.78,52.07 37.97,45.27 37.97,38.94 41,35.92 41,32.16 40.97,32.13 MEMORY.2 | v49.23,50.4 53.29,46.33 53.29,42.85 53.8,42.34 53.8,41.71 53.39,41.3 51.69,41.3 51.56,41.43 51.54,41.43 51.54,41.96 v51.23,42.27
MEM_ADDR2  (via drill 0.61)
  Top 0.254: v48.64,44.91 50.44,44.91 50.44,42.67 50.39,42.62 50.39,40.06 MICROCONTROLER.18
  Bottom 0.254: MEMORY.3 41.76,32.13 41.76,39.47 38.89,42.34 38.89,44.86 40.95,46.92 48.31,46.92 48.64,46.59 v48.64,44.91
MEM_ADDR3  (via drill 0.61)
  Top 0.254: v44.25,45.27 44.25,45.32 41.1,45.32 v40.97,45.44 | MICROCONTROLER.19 49.89,43.66 49.86,43.66 v49.61,43.92
  Bottom 0.254: v44.25,45.27 45.72,45.27 47.04,43.95 49.58,43.95 v49.61,43.92 | MEMORY.4 42.55,32.13 42.32,32.36 42.32,39.58 39.34,42.55 39.34,44.66 40.01,45.32 40.84,45.32 v40.97,45.44
MEM_ADDR4  (via drill 0.61)
  Top 0.254: v40.18,44.3 42.42,44.3 v42.42,44.43 | MICROCONTROLER.20 49.38,41.68 49.17,41.89 49.17,42.65 49.05,42.65 v48.64,43.06
  Bottom 0.254: v40.18,44.3 40.18,42.37 43.03,39.52 42.98,39.47 42.98,33.56 43.36,33.17 43.36,32.13 MEMORY.5 | v42.42,44.43 43.74,43.11 48.59,43.11 v48.64,43.06
MEM_ADDR5  (via drill 0.61)
  Top 0.254: v49.66,37.65 48.9,38.41 48.9,40.03 MICROCONTROLER.21
  Bottom 0.254: v49.66,37.65 53.52,33.78 53.52,32.36 53.75,32.13 MEMORY.18
MEM_ADDR6  (via drill 0.61)
  Top 0.254: v40.95,30.23 40.95,31.73 53.16,31.73 53.7,31.19 53.7,30.79 v53.9,30.58 | v32.61,30.33 32.99,30.33 32.99,30.2 33.2,30 MICROCONTROLER.60
  Bottom 0.254: v40.95,30.23 32.61,30.23 v32.61,30.33 | MEMORY.19 54.53,32.11 54.33,31.91 54.33,30.89 54.2,30.89 v53.9,30.58
MEM_ADDR7  (via drill 0.61)
  Top 0.254: v55.24,30.58 53.65,32.19 39.55,32.19 39.55,31.27 36.78,28.5 34.85,28.5 MICROCONTROLER.63
  Bottom 0.254: v55.24,30.58 55.24,32.01 55.35,32.11 MEMORY.20
MEM_ADDR8  (via drill 0.5)
  Top 0.254: MICROCONTROLER.64 37.45,28 38.2,28.76 39.22,28.76 39.45,28.98 v40.74,28.98 | v53.09,28.83 53.09,28.78 52.68,28.38 48.92,28.38 v48.82,28.27
  Bottom 0.254: MEMORY.21 56.16,30.13 55.7,29.67 53.92,29.67 v53.09,28.83 | v40.74,28.98 40.89,29.14 41.96,29.14 42.01,29.19 44.45,29.19 46.3,27.33 48.13,27.33 48.82,28.02 v48.82,28.27
MEM_ADDR9  (via drill 0.61)
  Top 0.254: v56.72,29.06 55.34,27.69 49.53,27.69 49.33,27.49 v44.78,27.49 | MICROCONTROLER.65 34.85,27.51 37.92,27.51 38.41,27.99 39.88,27.99 v40.39,27.49
  Bottom 0.254: v56.72,29.06 56.72,31.88 56.95,32.11 MEMORY.22 | v40.39,27.49 v44.78,27.49
MEM_ADDR10  (via drill 0.61)
  Top 0.254: 34.85,27 MICROCONTROLER.66 38.79,27 v38.81,27.03
  Bottom 0.254: MEMORY.23 56.95,20.53 56.72,20.75 56.72,21.47 54.69,23.5 51.21,23.5 48.06,26.65 39.19,26.65 v38.81,27.03
MEM_ADDR11  (via drill 0.61)
  Top 0.254: v32.61,26.62 33.1,26.62 33.2,26.52 MICROCONTROLER.67
  Bottom 0.254: v32.61,26.62 32.61,26.19 47.85,26.19 51.28,22.76 54.61,22.76 55.93,21.44 55.93,20.73 56.13,20.53 MEMORY.24
MEM_ADDR12  (via drill 0.61)
  Top 0.254: MICROCONTROLER.106 45.9,13.44 45.9,10.93 v46.46,10.37
  Bottom 0.254: MEMORY.25 55.35,20.5 55.12,20.27 55.12,17.68 47.83,10.39 47.78,10.34 46.48,10.34 v46.46,10.37
MEM_ADDR13  (via drill 0.61)
  Top 0.254: v50.19,16.18 49.07,17.3 46.63,17.3 46.63,16.34 46.33,16.03 46.33,15.14 46.38,15.09 MICROCONTROLER.107
  Bottom 0.254: v50.19,16.18 50.93,16.18 54.33,19.59 54.33,20.3 54.53,20.5 MEMORY.26
MEM_ADDR14  (via drill 0.61)
  Top 0.254: MICROCONTROLER.108 46.89,13.44 46.89,11.81 v47.47,11.23
  Bottom 0.254: MEMORY.27 53.75,20.5 53.52,20.27 53.52,19.56 50.98,17.02 49.35,17.02 49.35,13.11 v47.47,11.23
MEM_ADDR15  (via drill 0.61)
  Top 0.254: v47.17,15.68 47.4,15.45 47.4,13.46 MICROCONTROLER.109
  Bottom 0.254: v47.17,15.68 47.17,12.58 44.7,10.11 44.7,7.7 41.17,7.7 35.66,13.21 35.66,15.42 38.1,17.86 38.1,21.64 41.33,21.64 41.53,21.44 41.53,20.75 41.76,20.53 MEMORY.42
MEM_ADDR16  (via drill 0.61)
  Top 0.254: v40.97,16.49 42.37,15.09 42.37,13.46 MICROCONTROLER.99
  Bottom 0.254: v40.97,16.49 MEMORY.43
MEM_ADDR17  (via drill 0.61)
  Top 0.254: v40.13,18.52 42.82,15.83 42.82,15.14 42.88,15.09 MICROCONTROLER.100
  Bottom 0.254: v40.13,18.52 40.13,20.48 MEMORY.44
MEM_CE  (via drill 0.61)
  Top 0.254: v44.17,30.58 48.82,30.58 49.51,31.27 52.68,31.27 52.68,30.86 52.83,30.71 52.83,30.35 53.19,30 54.36,28.83 v55.27,28.83 | v57.4,26.01 61.42,26.01 MICROCONTROLER.153
  Bottom 0.254: v44.17,30.58 MEMORY.6 | v57.4,26.01 57.4,26.7 v55.27,28.83
MEM_IO0  (via drill 0.61)
  Top 0.254: MICROCONTROLER.104 44.88,15.29 43.94,15.29 43.28,15.95 43.28,18.65 47.19,18.65 v52.93,24.34 | v49.76,26.75 51.92,26.75 v51.94,26.77
  Bottom 0.254: MEMORY.7 44.98,32.11 45.19,31.91 45.19,29.67 46.53,28.32 47.57,28.32 48.31,29.06 49.35,29.06 49.76,28.65 v49.76,26.75 | v51.94,26.77 51.94,25.33 v52.93,24.34
MEM_IO1  (via drill 0.5)
  Top 0.254: MICROCONTROLER.105 45.38,10.12 46,9.5 47.81,9.5 48.21,9.1 48.21,8.36 v48.36,8.21 | v55.04,37.14 53.62,37.14 52.53,36.05 50.49,36.05 49.94,35.49 46.94,35.49 45.54,34.09 45.54,34.06 v45.29,33.81
  Bottom 0.254: v55.04,37.14 55.5,36.68 55.5,36.45 64.72,36.45 65.25,35.92 65.25,20.22 62.89,17.86 59.64,17.86 58.93,17.14 56.87,17.14 48.72,8.99 48.72,8.56 v48.36,8.21 | v45.29,33.81 45.29,33.73 45.74,33.28 45.74,32.12 MEMORY.8
MEM_IO2  (via drill 0.61)
  Top 0.254: v46.56,33.63 47.78,33.63 47.78,33.25 48.34,32.69 56.34,32.69 v56.34,33.63 | v63.65,21.09 63.07,20.5 61.44,20.5 MICROCONTROLER.142
  Bottom 0.254: v46.56,33.63 46.56,32.13 MEMORY.9 | v56.34,33.63 58.24,33.63 63.68,28.2 63.68,21.11 v63.65,21.09
MEM_IO3  (via drill 0.61)
  Top 0.254: v40.92,37.19 40.92,34.19 43.38,34.19 43.38,34.27 v44.02,34.9 | MICROCONTROLER.143 61.42,21.01 59.64,21.01 59.36,20.73 59.36,20.07 v59.21,19.92
  Bottom 0.254: v40.92,37.19 38.43,39.68 38.43,45.06 44.6,51.23 55.93,51.23 55.93,38.23 55.83,38.13 54.03,38.13 53.62,37.72 53.62,36.73 54.59,35.77 64.49,35.77 64.49,20.73 63.68,19.92 v59.21,19.92 | MEMORY.10 47.37,32.13 47.4,32.16 47.4,33.99 46.51,34.88 44.04,34.88 v44.02,34.9
MEM_IO4  (via drill 0.61)
  Top 0.254: v51.51,34.57 53.8,34.57 54.66,35.44 58.01,35.44 58.01,29.11 v54.91,26.01 | MICROCONTROLER.68 34.82,25.99 33.17,25.99 30.25,23.07 30.25,18.03 31.06,17.22 32.57,17.22 v32.61,17.17
  Bottom 0.254: v51.51,34.57 49.99,33.05 49.99,32.34 49.78,32.13 MEMORY.13 | v54.91,26.01 57.53,23.4 57.53,19.43 47.6,9.5 45.16,9.5 45.16,7.5 44.91,7.24 40.34,7.24 40.34,7.88 32.61,15.6 v32.61,17.17
MEM_IO5  (via drill 0.61)
  Top 0.254: v49.43,30 44.78,30 40.69,25.91 36.68,25.91 36.68,25.73 36.45,25.5 34.85,25.5 MICROCONTROLER.69
  Bottom 0.254: v49.43,30 50.32,30.89 50.32,31.88 50.55,32.11 MEMORY.14
MEM_IO6  (via drill 0.61)
  Top 0.254: v51.56,24.34 46.33,19.1 42.29,19.1 v42.29,17.55 | v38.86,15.9 37.06,17.71 v37.06,18.01 | MICROCONTROLER.70 34.82,25.02 33.22,25.02 31.77,23.57 31.22,23.01 31.22,20.78 v31.24,20.75
  Bottom 0.254: v51.56,24.34 51.08,24.82 51.08,30.79 51.13,30.84 51.13,31.88 MEMORY.15 | v42.29,17.55 41.81,17.07 41.81,16.13 41.33,15.65 38.86,15.65 v38.86,15.9 | v37.06,18.01 31.77,18.01 31.19,18.59 31.19,20.7 v31.24,20.75
MEM_IO7  (via drill 0.61)
  Top 0.254: MICROCONTROLER.73 34.85,23.52 39.62,23.52 44.42,28.32 47.6,28.32 48.34,29.06 50.55,29.06 v51.92,30.43
  Bottom 0.254: v51.92,30.43 51.92,31.88 52.15,32.11 MEMORY.16
MEM_IO8  (via drill 0.61)
  Top 0.254: MICROCONTROLER.74 34.85,23.02 40.41,23.02 41.96,24.57 43.87,24.57 v44.15,24.84 43.84,24.54
  Bottom 0.254: v44.15,24.84 48.54,24.84 51.92,21.47 51.92,20.75 52.15,20.53 MEMORY.29
MEM_IO9  (via drill 0.61)
  Top 0.254: MICROCONTROLER.75 33.12,22.51 33.12,22.43 v32.61,21.92
  Bottom 0.254: MEMORY.30 51.36,20.53 51.13,20.75 51.13,21.44 48.56,24.01 43.64,24.01 43.1,24.54 41.25,24.54 40.44,23.73 35.2,23.73 34.31,22.84 33.45,22.84 33.45,22.76 v32.61,21.92
MEM_IO10  (via drill 0.61)
  Top 0.254: MICROCONTROLER.76 34.85,22 36.45,22 36.68,22.23 36.68,22.25 41.1,22.25 41.1,22.33 v42.47,23.7
  Bottom 0.254: MEMORY.31 50.55,20.53 50.32,20.75 50.32,21.47 49.63,22.15 48.67,22.15 48.67,22.89 48.01,23.55 43.05,23.55 42.9,23.7 v42.47,23.7
MEM_IO11  (via drill 0.61)
  Top 0.254: v47.83,22.53 46.71,22.53 46.38,22.86 45.67,22.86 45.01,22.2 45.01,21.67 44.53,21.19 38.1,21.19 38.1,21.31 37.62,21.8 36.91,21.8 36.63,21.52 34.9,21.52 34.87,21.49 34.85,21.49 MICROCONTROLER.77
  Bottom 0.254: v47.83,22.53 47.83,21.69 49.28,21.69 49.53,21.44 49.53,20.75 49.76,20.53 MEMORY.32
MEM_IO12  (via drill 0.61)
  Top 0.254: v37.26,20.96 36.5,20.96 36.45,21.01 34.85,21.01 MICROCONTROLER.78
  Bottom 0.254: v37.26,20.96 37.26,22.86 46.38,22.86 46.86,22.38 46.86,22.3 47.12,22.05 47.12,20.75 47.35,20.53 MEMORY.35
MEM_IO13  (via drill 0.61)
  Top 0.254: v46.02,22.02 43.76,19.76 39.29,19.76 39.29,16.66 40.87,15.09 MICROCONTROLER.96
  Bottom 0.254: v46.02,22.02 46.33,21.72 46.33,20.75 46.56,20.53 MEMORY.36
MEM_IO14  (via drill 0.61)
  Top 0.254: v45.8,17.35 44.76,16.31 v44.12,16.31 | MICROCONTROLER.97 41.38,13.44 41.38,11.84 41.15,11.48 40.94,11.48 v40.66,11.2
  Bottom 0.254: v45.8,17.35 45.8,20.48 45.77,20.5 MEMORY.37 | v44.12,16.31 40.97,13.16 40.64,12.83 40.64,11.23 v40.66,11.2
MEM_IO15  (via drill 0.61)
  Top 0.254: MICROCONTROLER.98 41.88,13.44 41.88,11.26 v41.99,11.15
  Bottom 0.254: MEMORY.38 44.96,14.43 42.19,11.66 42.19,11.36 v41.99,11.15
MEM_LB  (via drill 0.61)
  Top 0.254: v44.17,22.02 47.32,25.17 56.34,25.17 56.34,26.6 58.04,28.3 58.75,28.3 58.75,28.68 59.59,29.52 59.59,33.78 59.79,33.99 61.42,33.99 MICROCONTROLER.169
  Bottom 0.254: v44.17,22.02 44.17,20.53 MEMORY.39
MEM_OE  (via drill 0.5)
  Top 0.254: v42.8,22.05 42.82,22.1 46.61,25.89 52.45,25.89 52.86,26.29 53.42,26.29 v53.44,26.27 | v54.53,24.36 55.3,24.36 57.15,22.5 MICROCONTROLER.146
  Bottom 0.254: MEMORY.41 42.56,21.86 v42.8,22.05 | v53.44,26.27 53.44,25.45 v54.53,24.36
MEM_UB  (via drill 0.61)
  Top 0.254: v36.5,15.06 35.94,15.06 35.48,15.52 29.18,15.52 28.32,16.39 28.32,21.97 29.18,22.84 29.18,53.29 30.02,54.13 30.02,54.69 30.66,55.32 v42.14,55.32 | v56.77,37.54 59.82,34.5 61.42,34.5 MICROCONTROLER.170
  Bottom 0.254: v36.5,15.06 41.4,15.06 42.27,15.93 42.27,16.34 43.13,17.2 43.13,20.27 MEMORY.40 | v42.14,55.32 44.4,53.06 56.77,53.06 v56.77,37.54
MEM_WE  (via drill 0.61)
  Top 0.254: MICROCONTROLER.147 61.42,22.99 58.93,22.99 57.94,23.98 57.94,24.41 v57.66,24.69
  Bottom 0.254: MEMORY.17 52.96,30.02 51.87,28.93 51.87,28.63 53.16,27.33 54.84,27.33 57.15,25.02 57.33,25.02 v57.66,24.69
N$1  (via drill 0.61)
  Top 0.254: v72.52,44.5 72.52,41.12 70.05,41.12 DAC.8 | R1.2 65.94,37.06 66.52,37.06 v67.97,38.51
  Bottom 0.254: v72.52,44.5 73.1,43.92 73.1,39.3 71.25,37.44 69.6,37.44 68.53,38.51 v67.97,38.51
N$2
  Top 0.254: DAC.9 70.03,40.62 68.91,40.62 68.91,37.27 68.73,37.09 R2.2
N$3
  Top 0.813: D1.C R12.2
N$4
  Top 0.254: MICROCONTROLER.165 64.12,32.01 D2.A
N$5
  Top 0.254: R3.2 31.17,52.38 31.14,52.4 31.14,54.21 RASPBERRY_PI.P1_19
N$6
  Top 0.406: C25.2 23.65,9.38 24.38,10.11 24.38,12.07 24.18,12.27 23.38,12.27 U$1.8
N$7
  Top 0.254: R4.2 33.76,52.43 33.68,52.51 33.68,54.21 RASPBERRY_PI.P1_21
N$8
  Top 0.254: R5.2 36.25,52.4 36.22,52.43 36.22,54.21 RASPBERRY_PI.P1_23
N$9
  Top 0.254: R9.2 56.87,42.83 MICROCONTROLER.5
N$10
  Top 0.254: R8.2 58.83,43.39 57.38,41.94 MICROCONTROLER.4
N$11  (via drill 0.61)
  Top 0.254: v61.29,42.37 R7.2 | v58.5,37.82 57.89,38.43 57.89,40.03 MICROCONTROLER.3
  Bottom 0.254: v61.29,42.37 60.5,41.58 60.5,41.56 58.5,39.55 v58.5,37.82
N$12  (via drill 0.61)
  Top 0.254: v64.34,41.15 R6.2 | v59.94,39.8 58.9,39.8 58.9,40.03 MICROCONTROLER.1
  Bottom 0.254: v64.34,41.15 62.99,39.8 v59.94,39.8
N$13
  Top 0.254: 19.05,12.3 U$1.5
  Top 0.406: 19.05,12.3 18.26,12.3 17.78,11.81 17.78,11.2 19.56,9.43 20.41,9.43 C25.1
N$14
  Top 0.254: D2.C 66.75,29.25 R13.1
N$15
  Top 0.254: MICROCONTROLER.125 55.38,11.55 56.08,10.85 56.08,9.42 56.82,8.69 56.82,8.18 56.06,7.42 55.31,7.42 C26.2 55.18,7.29
N$16
  Top 0.254: MICROCONTROLER.81 33.25,19.5 33.02,19.74 31.43,19.74 C27.2
N$17
  Bottom 0.61: VREF1.5 77.9,43.51 78.41,44.02 78.41,44.3 78,44.7 77.04,44.7 76.71,45.03 C28.+
OSC_IN
  Top 0.254: C15.2 43.64,53.98 9C-8.000MEEJ-T.2 43.71,49.94 45.09,48.57 45.09,42.88 44.88,42.67 MICROCONTROLER.29
OSC_OUT  (via drill 0.61)
  Top 0.254: C14.2 53.14,52.86 9C-8.000MEEJ-T.1 53.01,50.02 50.04,50.02 v46.1,46.08 | v43.79,42.27 44.37,41.68 MICROCONTROLER.30
  Bottom 0.254: v43.79,42.27 42.47,43.59 41.58,43.59 41.58,44.78 42.9,46.1 46.1,46.1 v46.1,46.08
PH13  (via drill 0.25, 0.4)
  Top 0.254: MICROCONTROLER.128 56.91,10.61 58.04,9.5 v58.04,9.47 | v63.4,3.05 63.4,2.36 67.03,2.36 67.18,2.52 67.18,5.16 67.23,5.16 GPIO.4 | v58.98,5.97 v60.45,4.5
  Bottom 0.254: v58.04,9.47 58.06,9.47 58.93,8.61 58.93,6.02 v58.98,5.97 | v63.4,3.05 61.95,4.5 v60.45,4.5
PH14  (via drill 0.25)
  Top 0.254: MICROCONTROLER.129 57.38,11.1 v58.04,10.44
  Bottom 0.254: v58.04,10.44 59.59,8.89 59.66,8.79 59.72,8.74 59.72,2.31 68.96,2.31 69.72,3.07 69.72,5.16 69.77,5.16 GPIO.3
PH15  (via drill 0.25, 0.4)
  Top 0.254: MICROCONTROLER.130 57.86,13.43 57.86,11.35 58.04,11.15 58.27,11.15 v59,10.41 | v64.39,4.04 66.02,5.66 66.45,5.66 v66.7,5.92
  Bottom 0.254: v64.39,4.04 64.39,6.15 62.38,8.15 62.38,8.31 61.04,8.31 59,10.34 v59,10.41 | GPIO.2 73.53,6.53 72.06,8 67.94,8 66.8,6.86 66.8,6.02 v66.7,5.92
PI_IO1  (via drill 0.61)
  Top 0.254: MICROCONTROLER.40 39.4,40.06 39.4,42.6 36.17,45.82 35.74,45.82 34.57,46.99 32.87,46.99 32.87,47.04 v32.11,47.81 | RASPBERRY_PI.P1_7 15.9,54.21 15.9,53.14 26.01,53.14 v26.87,52.28
  Bottom 0.254: v26.87,52.28 27.1,52.05 27.86,52.05 v32.11,47.81
PI_IO2  (via drill 0.25, 0.61)
  Top 0.254: MICROCONTROLER.41 38.89,42.45 36.35,44.99 34.59,44.99 v33.55,46.03 | v24.77,55.35 24.71,55.3 21.74,55.3 20.98,54.53 20.98,54.25 RASPBERRY_PI.P1_11
  Bottom 0.254: v33.55,46.03 33.45,46.13 33.45,47.78 32.84,48.39 32.84,48.41 27.13,54.13 27.13,54.69 26.49,55.32 24.79,55.32 v24.77,55.35
PI_IO3  (via drill 0.61)
  Top 0.254: MICROCONTROLER.42 38.38,41.68 37.41,42.65 34.37,42.65 33.98,43.03 32.11,43.03 v32,43.13
  Bottom 0.254: 23.52,54.21 RASPBERRY_PI.P1_13 23.52,54.21 23.52,51.9 31.52,43.89 31.52,43.59 31.55,43.59 v32,43.13
PI_IO4  (via drill 0.61)
  Top 0.254: v33.78,40.69 36.68,37.8 36.68,36.5 34.85,36.5 MICROCONTROLER.47
  Bottom 0.254: v33.78,40.69 32.84,40.69 32.84,43.79 26.04,50.6 26.04,54.21 RASPBERRY_PI.P1_15
PI_IO5  (via drill 0.61)
  Top 0.254: MICROCONTROLER.119 52.38,15.19 49.38,18.19 44.12,18.19 v44.12,17.81 | RASPBERRY_PI.P1_16 26.06,56.75 27.13,55.68 27.13,54.13 27.71,53.55 27.71,15.06 35.28,15.06 35.28,14.96 v36.5,13.74
  Bottom 0.254: v36.5,13.74 36.6,13.85 40.84,13.85 42.72,15.72 42.72,16.13 42.73,16.13 43.89,17.3 43.89,17.58 v44.12,17.81
PI_MISO  (via drill 0.61)
  Top 0.254: v35.74,48.29 35.74,48.72 R4.1 | MICROCONTROLER.52 34.85,33.99 36.47,33.99 36.58,33.89 37.03,33.89 v37.11,33.81
  Bottom 0.254: v35.74,48.29 36.22,47.81 36.22,34.7 v37.11,33.81
PI_MOSI
  Top 0.254: R3.1 31.17,35.54 33.2,33.51 MICROCONTROLER.53
PI_SCK  (via drill 0.61)
  Top 0.254: v37.06,35.11 36.47,34.52 34.85,34.52 MICROCONTROLER.51 | R5.1 36.25,50.68 36.96,49.97 36.96,48.39 v37.06,48.29
  Bottom 0.254: v37.06,35.11 v37.06,48.29
PI_SS  (via drill 0.61)
  Top 0.254: MICROCONTROLER.50 32.36,35 32.36,35.18 31.77,35.77 31.77,40.08 v33.68,41.99
  Bottom 0.254: RASPBERRY_PI.P1_24 36.2,56.75 34.9,55.45 34.9,43.13 34.82,43.13 v33.68,41.99
PI_UART_RX  (via drill 0.5)
  Top 0.254: MICROCONTROLER.120 52.88,11.68 52.55,11.35 51.87,11.35 50.88,10.36 50.88,9.93 v50.65,9.71
  Bottom 0.254: RASPBERRY_PI.P1_10 18.42,56.66 19.68,55.4 19.68,53.44 19.66,53.42 19.66,51.1 20.12,50.65 22.05,50.65 26.7,46 26.7,14.79 28.6,14.79 33.43,9.96 35.76,9.96 40.03,5.69 45.97,5.69 47.07,6.79 48.34,6.79 50.65,9.1 v50.65,9.71
PI_UART_TX  (via drill 0.5)
  Top 0.254: MICROCONTROLER.121 53.38,11.32 v52.15,10.09
  Bottom 0.254: RASPBERRY_PI.P1_8 15.88,56.56 17.14,55.3 17.14,50.6 17.48,50.19 21.82,50.19 25.81,46.28 25.81,14.81 26.72,13.9 28.3,13.9 33.2,8.99 35.66,8.99 39.67,4.98 46.15,4.98 47.45,6.28 48.59,6.28 50.7,8.38 51.16,8.38 51.71,8.94 51.71,9.65 v52.15,10.09
RST0  (via drill 0.61)
  Top 0.254: 41.43,43.39 43.94,43.39 C13.+ | 41.43,43.39 S1.4 | 43.87,40.03 MICROCONTROLER.31 43.88,37.79 v43.81,37.72 | 41.43,43.39 41.43,43.36 v42.52,42.27
  Bottom 0.254: v42.52,42.27 42.57,42.22 42.57,41.35 43.84,40.08 43.84,37.75 v43.81,37.72
RST1  (via drill 0.5)
  Top 0.254: S1.3 34.69,43.37 v32.13,45.93 | v26.87,50.9 26.87,14.63 28.78,14.63 33.33,10.09 35.51,10.09 39.8,5.79 55.93,5.79 61.19,11.03 63.86,11.03 68.71,15.88 68.71,21.85 68.96,22.1 70.41,22.1 70.46,22.15
  Top 0.305: PROGRAM.5 81.4,12.42 80.57,13.26 80.57,14.58 76.63,18.52 76.63,20.09 74.7,22.02 74.14,22.02 73.25,22.91 71.53,22.91 70.79,22.17 70.48,22.17 70.46,22.15
  Bottom 0.254: v26.87,50.9 27.15,50.9 v32.13,45.93
RTC_OSC_IN
  Top 0.254: C16.2 53.92,45.52 53.92,44.25 32.768KHZ.P$1 53.95,44.1 54.86,43.18 54.86,40.06 MICROCONTROLER.9
RTC_OSC_OUT
  Top 0.254: C17.2 49.4,46.1 50.14,45.37 51.31,45.37 51.31,44.25 32.768KHZ.P$2 51.44,44.17 52.5,43.11 53.03,43.11 53.03,43.01 54.15,41.89 54.38,41.89 MICROCONTROLER.10
SPI2_MISO  (via drill 0.25)
  Top 0.254: MICROCONTROLER.133 62.61,16 v63.3,15.24 | v72.95,15.34 72.95,7.95 72.26,7.26 72.26,4.8 SPI_2.3
  Bottom 0.254: v63.3,15.24 63.68,15.27 63.86,15.44 64.03,15.44 64.26,15.67 64.41,15.67 64.49,15.75 65.3,15.75 65.46,15.6 72.69,15.6 v72.95,15.34
SPI2_MOSI  (via drill 0.25)
  Top 0.254: MICROCONTROLER.134 63.2,16.5 v63.6,16.1 | v73.97,15.57 73.97,7.98 74.8,7.14 74.8,4.8 SPI_2.4
  Bottom 0.254: v63.6,16.1 63.73,16.23 65.38,16.23 65.66,16 66.85,16 66.95,16.1 73.43,16.1 v73.97,15.57 73.64,15.9
SPI2_NSS  (via drill 0.25)
  Top 0.254: MICROCONTROLER.131 58.38,11.72 58.47,11.63 58.73,11.63 v58.95,11.4
  Bottom 0.254: v58.95,11.4 60.68,9.68 61.8,9.68 v63.04,8.43 63.12,8.33 64.8,6.66 64.8,4.75 SPI_2.1
SPI2_SCK  (via drill 0.25)
  Top 0.254: MICROCONTROLER.132 58.88,12.16 59.37,12.16 59.37,11.96 v59.97,11.35
  Bottom 0.254: v59.97,11.35 61.01,10.31 62.71,10.31 v64.59,8.43 64.67,8.33 64.67,7.42 64.69,7.42 65.71,6.4 65.71,5.16 66.04,4.83 67.26,4.83 SPI_2.2
SW_CLK  (via drill 0.5)
  Top 0.254: MICROCONTROLER.137 63.01,18 63.8,18.8 66.73,18.8 v66.75,18.77
  Bottom 0.254: v66.75,18.77 77.19,18.77 79.91,16.06 79.91,10.54 80.57,9.88 PROGRAM.4
SWD_IO  (via drill 0.5)
  Top 0.254: MICROCONTROLER.124 54.88,11.82 54.89,11.81 54.89,11.38 55.65,10.62 55.65,9.4 | 55.65,9.4 55.65,9.32 | 55.65,9.4 55.7,9.27 55.7,8.56 55.73,8.56 55.73,8.49 v55.83,8.38
  Bottom 0.254: v55.83,8.38 55.96,8.51 56.29,8.51 56.29,13.11 56.95,13.77 58.01,13.77 58.45,14.2 59.51,14.2 61.7,12.01 66.42,12.01 66.5,12.09 68.78,9.8 77.06,9.8 79.53,7.34 PROGRAM.3
VBAT  (via drill 0.61)
  Top 0.254: v59.31,46.38 59.31,46.31 56.03,46.31 55.5,45.77 55.5,42.67 56.36,41.81 56.36,40.06 MICROCONTROLER.6 | BAT1.PWR@1 67.16,54.23 65.23,54.23 v64.39,53.39
  Bottom 0.254: v59.31,46.38 59.31,48.31 v64.39,53.39

## Text on the board
tPlace: SDA | SCL | + | + | +5 | + | + | + | + | + | + | + | GND | 1 | + | USB 5v 3A | + | GND | + | + | GND | +3.3 | +5 | GND | POWER | + | + | GND | + | RST | GND | +12 | + | PH13 | PH14 | PH15 | SW_CLK | + | + | SWD_IO | GND | GND | +12V | +5V | +3V3 | GND | SPI2 | +3.3 | Lazey Projector v1.0 | SS | SCK | MISO | MOSI | GND | GND
bPlace: BRIGHTNESS | GND | GND | +5 | CHANNEL_Y | +12V | GND | CHANNEL_X | GND | SPARE | +12 | GND | RESET | GND | SW_CLK | SWD_IO | GND | +3V3 | GND